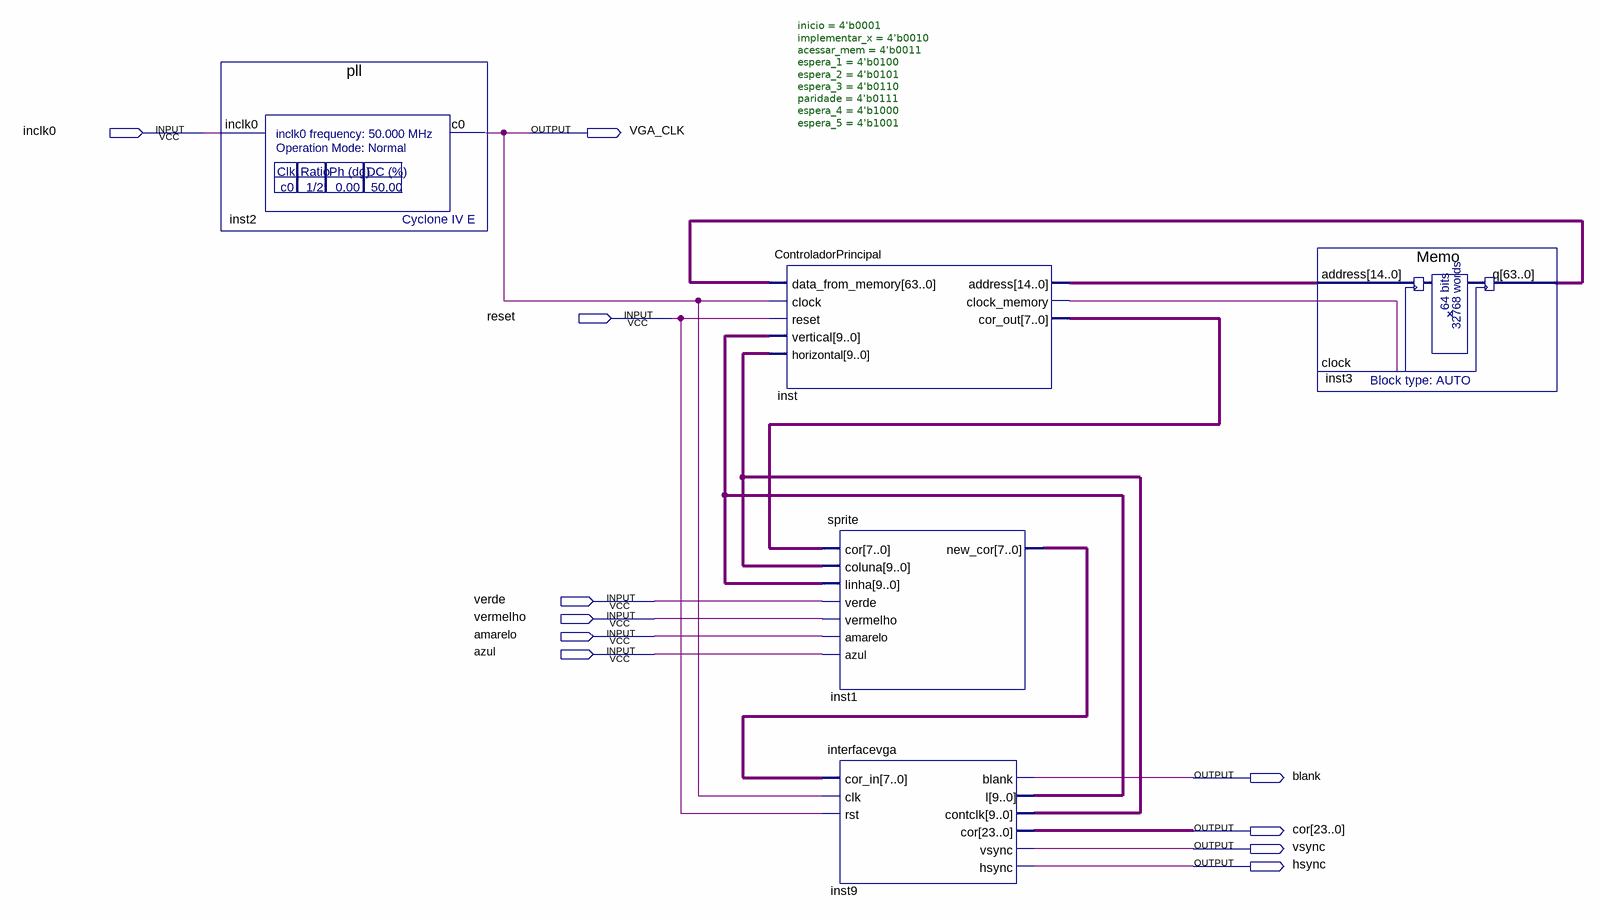
[diagram p0: schematic sheet]
// Quartus schematic GeniusVGA.bdf as structural Verilog: 5 symbols, 11 pins
module GeniusVGA (
  input  inclk0,
  input  reset,
  input  verde,
  input  vermelho,
  input  amarelo,
  input  azul,
  output VGA_CLK,
  output blank,
  output [23:0] cor,
  output vsync,
  output hsync
);

  wire inst_clock_memory;
  wire [7:0] inst1_new_cor, inst_cor_out;
  wire [9:0] inst9_contclk, inst9_l;
  wire [14:0] inst_address;
  wire [63:0] inst3_q;

  pll inst2 (.inclk0(inclk0), .c0(VGA_CLK));
  ControladorPrincipal #(.inicio(4'b0001), .implementar_x(4'b0010), .acessar_mem(4'b0011), .espera_1(4'b0100), .espera_2(4'b0101), .espera_3(4'b0110), .paridade(4'b0111), .espera_4(4'b1000), .espera_5(4'b1001)) inst (
    .data_from_memory(inst3_q), .clock(VGA_CLK), .reset(reset), .vertical(inst9_l),
    .horizontal(inst9_contclk), .address(inst_address), .clock_memory(inst_clock_memory),
    .cor_out(inst_cor_out));
  sprite inst1 (
    .cor(inst_cor_out), .coluna(inst9_contclk), .linha(inst9_l), .verde(verde), .vermelho(vermelho),
    .amarelo(amarelo), .azul(azul), .new_cor(inst1_new_cor));
  interfacevga inst9 (
    .cor_in(inst1_new_cor), .clk(VGA_CLK), .rst(reset), .blank(blank), .l(inst9_l), .contclk(inst9_contclk),
    .cor(cor), .vsync(vsync), .hsync(hsync));
  Memo inst3 (.address(inst_address), .clock(inst_clock_memory), .q(inst3_q));
endmodule
